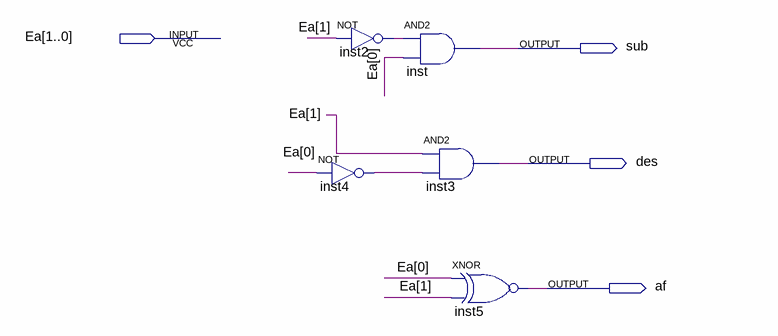
[diagram p0: schematic sheet]
// Quartus schematic LS.bdf as structural Verilog: 5 symbols, 4 pins
module LS (
  input  [1:0] Ea,
  output sub,
  output des,
  output af
);

  wire inst2_out, inst4_out;

  not inst4 (inst4_out, Ea[0]);
  not inst2 (inst2_out, Ea[1]);
  and inst (sub, inst2_out, Ea[0]);
  and inst3 (des, Ea[1], inst4_out);
  xnor inst5 (af, Ea[0], Ea[1]);
endmodule
